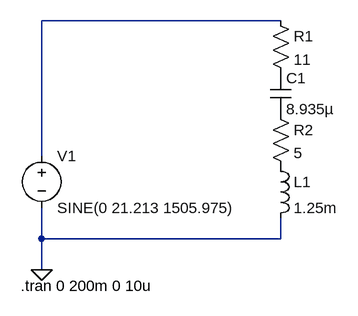
[diagram p0: schematic Схема6.asc]
Схема6.asc, the LTspice schematic file:
Version 4
SHEET 1 880 680
WIRE -1024 16 -1392 16
WIRE -1392 224 -1392 16
WIRE -1392 352 -1392 304
WIRE -1024 352 -1024 320
WIRE -1024 352 -1392 352
WIRE -1392 400 -1392 352
FLAG -1392 400 0
SYMBOL voltage -1392 208 R0
WINDOW 123 0 0 Left 0
WINDOW 39 0 0 Left 0
SYMATTR InstName V1
SYMATTR Value SINE(0 21.213 1505.975)
SYMBOL res -1040 0 R0
SYMATTR InstName R1
SYMATTR Value 11
SYMBOL cap -1040 96 R0
SYMATTR InstName C1
SYMATTR Value 8.935µ
SYMBOL res -1040 144 R0
SYMATTR InstName R2
SYMATTR Value 5
SYMBOL ind -1040 224 R0
SYMATTR InstName L1
SYMATTR Value 1.25m
TEXT -1424 424 Left 2 !.tran 0 200m 0 10u

The netlist it stands for:
* Схема6.asc
V1 N001 0 SINE(0 21.213 1505.975)
R1 N001 P001 11
C1 P001 P002 8.935µ
R2 P002 P003 5
L1 P003 0 1.25m
.tran 0 200m 0 10u
.backanno
.end